# Altium project PCB_Project.PrjPcb
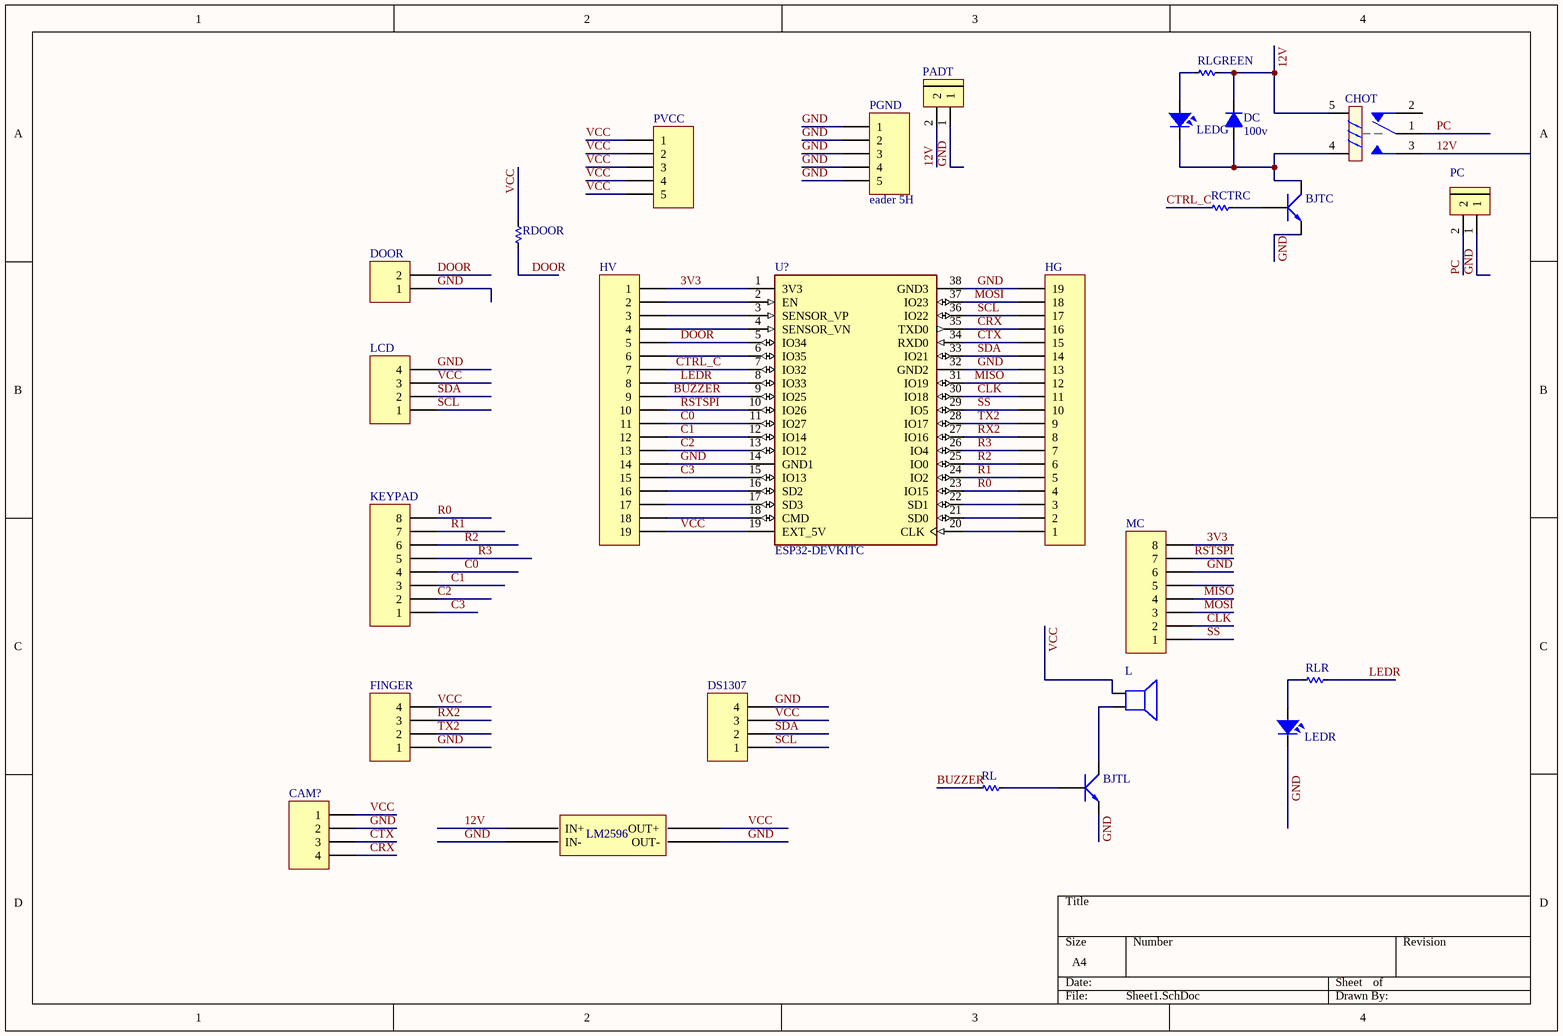
[diagram p0: Sheet1.SchDoc]
1 sheet, 27 parts. Net scope: global (net labels, ports and power ports of the same name join across sheets).
Board file: PCB2.PcbDoc

## Sheet Sheet1.SchDoc
size A4; SheetNumber: 1; SheetTotal: 1

### Parts
BJTC  (no value)  [TO92]
BJTL  (no value)  [TO92]
CAM?  (no value)  [HDR1X4H]
CHOT  (no value)  [RELAY 5]
DC  100v  [DIODE 1A]
DOOR  (no value)  [HDR1X2H]
DS1307  (no value)  [HDR1X4H]
FINGER  (no value)  [HDR1X4H]
HG  (no value)  [HDR1X19H]
HV  (no value)  [HDR1X19H]
KEYPAD  (no value)  [HDR1X8H]
L  (no value)  [Coi Chip Speacker]
L?  BUCK_LM2596  [BUCK_LM2596]  (value not drawn)
LCD  (no value)  [HDR1X4H]
LEDG  LED  [LED-3MM-YELLOW]  (value not drawn)
LEDR  LED  [LED-3MM-YELLOW]  (value not drawn)
MC  (no value)  [HDR1X8H]
PADT  (no value)  [Con 2 KF301 5.08]
PC  (no value)  [Con 2 KF301 5.08]
PGND  eader 5H  [HDR1X5H]
PVCC  (no value)  [HDR1X5H]
RCTRC  (no value)  [RES-1/2W]
RDOOR  (no value)  [RES-1/2W]
RL  (no value)  [RES-1/2W]
RLGREEN  (no value)  [RES-1/2W]
RLR  (no value)  [RES-1/2W]
U?  ESP32-DEVKITC  [MODULE_ESP32-DEVKITC]

### Nets
3V3: HV.1 MC.8 U?.1(3V3)
12V: CHOT.3 CHOT.5 DC.2(K) L?.1(IN+) PADT.2 RLGREEN.1
BUZZER: HV.9 RL.2 U?.9(IO25)
C0: HV.11 KEYPAD.4 U?.11(IO27)
C1: HV.12 KEYPAD.3 U?.12(IO14)
C2: HV.13 KEYPAD.2 U?.13(IO12)
C3: HV.15 KEYPAD.1 U?.15(IO13)
CLK: HG.11 MC.2 U?.30(IO18)
CRX: CAM?.4 HG.16 U?.35(TXD0)
CTRL_C: HV.7 RCTRC.2 U?.7(IO32)
CTX: CAM?.3 HG.15 U?.34(RXD0)
DOOR: DOOR.2 HV.5 RDOOR.2 U?.5(IO34)
GND: BJTC.1(E) BJTL.1(E) CAM?.2 DOOR.1 DS1307.4 FINGER.1 HG.13 HG.19 HV.14 L?.2(IN-) L?.3(OUT-) LCD.4 LEDR.2 MC.6 PADT.1 PC.1 PGND.1 PGND.2 PGND.3 PGND.4 PGND.5 U?.14(GND1) U?.32(GND2) U?.38(GND3)
LEDR: HV.8 RLR.1 U?.8(IO33)
MISO: HG.12 MC.4 U?.31(IO19)
MOSI: HG.18 MC.3 U?.37(IO23)
PC: CHOT.1 PC.2
R0: HG.4 KEYPAD.8 U?.23(IO15)
R1: HG.5 KEYPAD.7 U?.24(IO2)
R2: HG.6 KEYPAD.6 U?.25(IO0)
R3: HG.7 KEYPAD.5 U?.26(IO4)
RSTSPI: HV.10 MC.7 U?.10(IO26)
RX2: FINGER.3 HG.8 U?.27(IO16)
SCL: DS1307.1 HG.17 LCD.1 U?.36(IO22)
SDA: DS1307.2 HG.14 LCD.2 U?.33(IO21)
SS: HG.10 MC.1 U?.29(IO5)
TX2: FINGER.2 HG.9 U?.28(IO17)
VCC: CAM?.1 DS1307.3 FINGER.4 HV.19 L.1 L?.4(OUT+) LCD.3 PVCC.1 PVCC.2 PVCC.3 PVCC.4 PVCC.5 RDOOR.1 U?.19(EXT_5V)
NetBJTC_2: BJTC.2(C) CHOT.4 DC.1(A) LEDG.2
NetBJTC_3: BJTC.3(B) RCTRC.1
NetBJTL_2: BJTL.2(C) L.2
NetBJTL_3: BJTL.3(B) RL.1
NetHG_1: HG.1 U?.20(CLK)
NetHG_2: HG.2 U?.21(SD0)
NetHG_3: HG.3 U?.22(SD1)
NetHV_2: HV.2 U?.2(EN)
NetHV_3: HV.3 U?.3(SENSOR_VP)
NetHV_4: HV.4 U?.4(SENSOR_VN)
NetHV_6: HV.6 U?.6(IO35)
NetHV_16: HV.16 U?.16(SD2)
NetHV_17: HV.17 U?.17(SD3)
NetHV_18: HV.18 U?.18(CMD)
NetLEDG_1: LEDG.1 RLGREEN.2
NetLEDR_1: LEDR.1 RLR.2

Not connected (* = marked no-connect by the designer): CHOT 2; MC 5

### Notes on the sheet
- (in symbol BUCK_LM2596) LM2596

### Library data of the parts
BJTC BJTL = C1815: NPN transistor; Value: C9014
CAM? DS1307 FINGER LCD = Header 4H: Header, 4-Pin, Right Angle; LatestRevisionDate: 17-Jul-2002; LatestRevisionNote: Re-released for DXP Platform.; Publisher: Altium Limited
CHOT = Relay 5: Relay SPDT,10A - 12VDC 5 Pin; Value: Relay SPDT, 10A, 12V
DC = Diode 1N4007: Cắm; Ten_Linh_Kien: Diode 1N4007 1A (DIP); Don_Vi: Con; Ma_Hang: MH001063; Ghi Chu: *; Kieu_Chan: *; Chung_Loai: Cắm
DOOR = Header 2H: Header, 2-Pin, Right Angle; LatestRevisionDate: 17-Jul-2002; LatestRevisionNote: Re-released for DXP Platform.; Publisher: Altium Limited
HG HV = Header 19H: Header, 19-Pin, Right Angle; LatestRevisionDate: 17-Jul-2002; LatestRevisionNote: Re-released for DXP Platform.; Publisher: Altium Limited
KEYPAD MC = Header 8H: Header, 8-Pin, Right Angle; LatestRevisionDate: 17-Jul-2002; LatestRevisionNote: Re-released for DXP Platform.; Publisher: Altium Limited
L = Coi Chip Speaker: Còi chip
LEDG LEDR = LED: LED Single colour Green and Red; Value: LED 3 ly Single Colour
PADT PC = CON 2 KF301: Cắm; Ma_Hang: MH000987; Ten_Linh_Kien: CON 2 KF301-2P 5.08MM Xanh Dương; Don_Vi: Con; Chung_Loai: Cắm; Ghi_Chu: *; Kieu_Chan: *
PGND PVCC = Header 5H: Header, 5-Pin, Right Angle; LatestRevisionDate: 17-Jul-2002; LatestRevisionNote: Re-released for DXP Platform.; Publisher: Altium Limited
RCTRC RDOOR RL RLGREEN RLR = Res: Manufacturer: Generic Components; Class: Passive; SubClass: R; Published: 08/06/2000; Publisher: Altium Hobart Technology Centre
U? = ESP32-DEVKITC: ESP32-WROOM-32UE series Transceiver; 802.11 b/g/n (Wi-Fi, WiFi, WLAN), Bluetooth Â® Smart Ready 4.x Dual Mode Evaluation Board; MF: Espressif Systems; Value: *; SnapEDA_Link: https://www.snapeda.com/parts/ESP32-DEVKITC/Espressif+Systems/view-part/?ref=snap; MP: ESP32-DEVKITC; Purchase-URL: https://pricing.snapeda.com/search/part/ESP32-DEVKITC/?ref=eda; Check_prices: https://www.snapeda.com/parts/ESP32-DEVKITC/Espressif+Systems/view-part/?ref=eda; Availability: In Stock; Price: None; Package: None